# EAGLE design Adafruit VS1053 Amp FeatherWing (EAGLE 6.6.0)
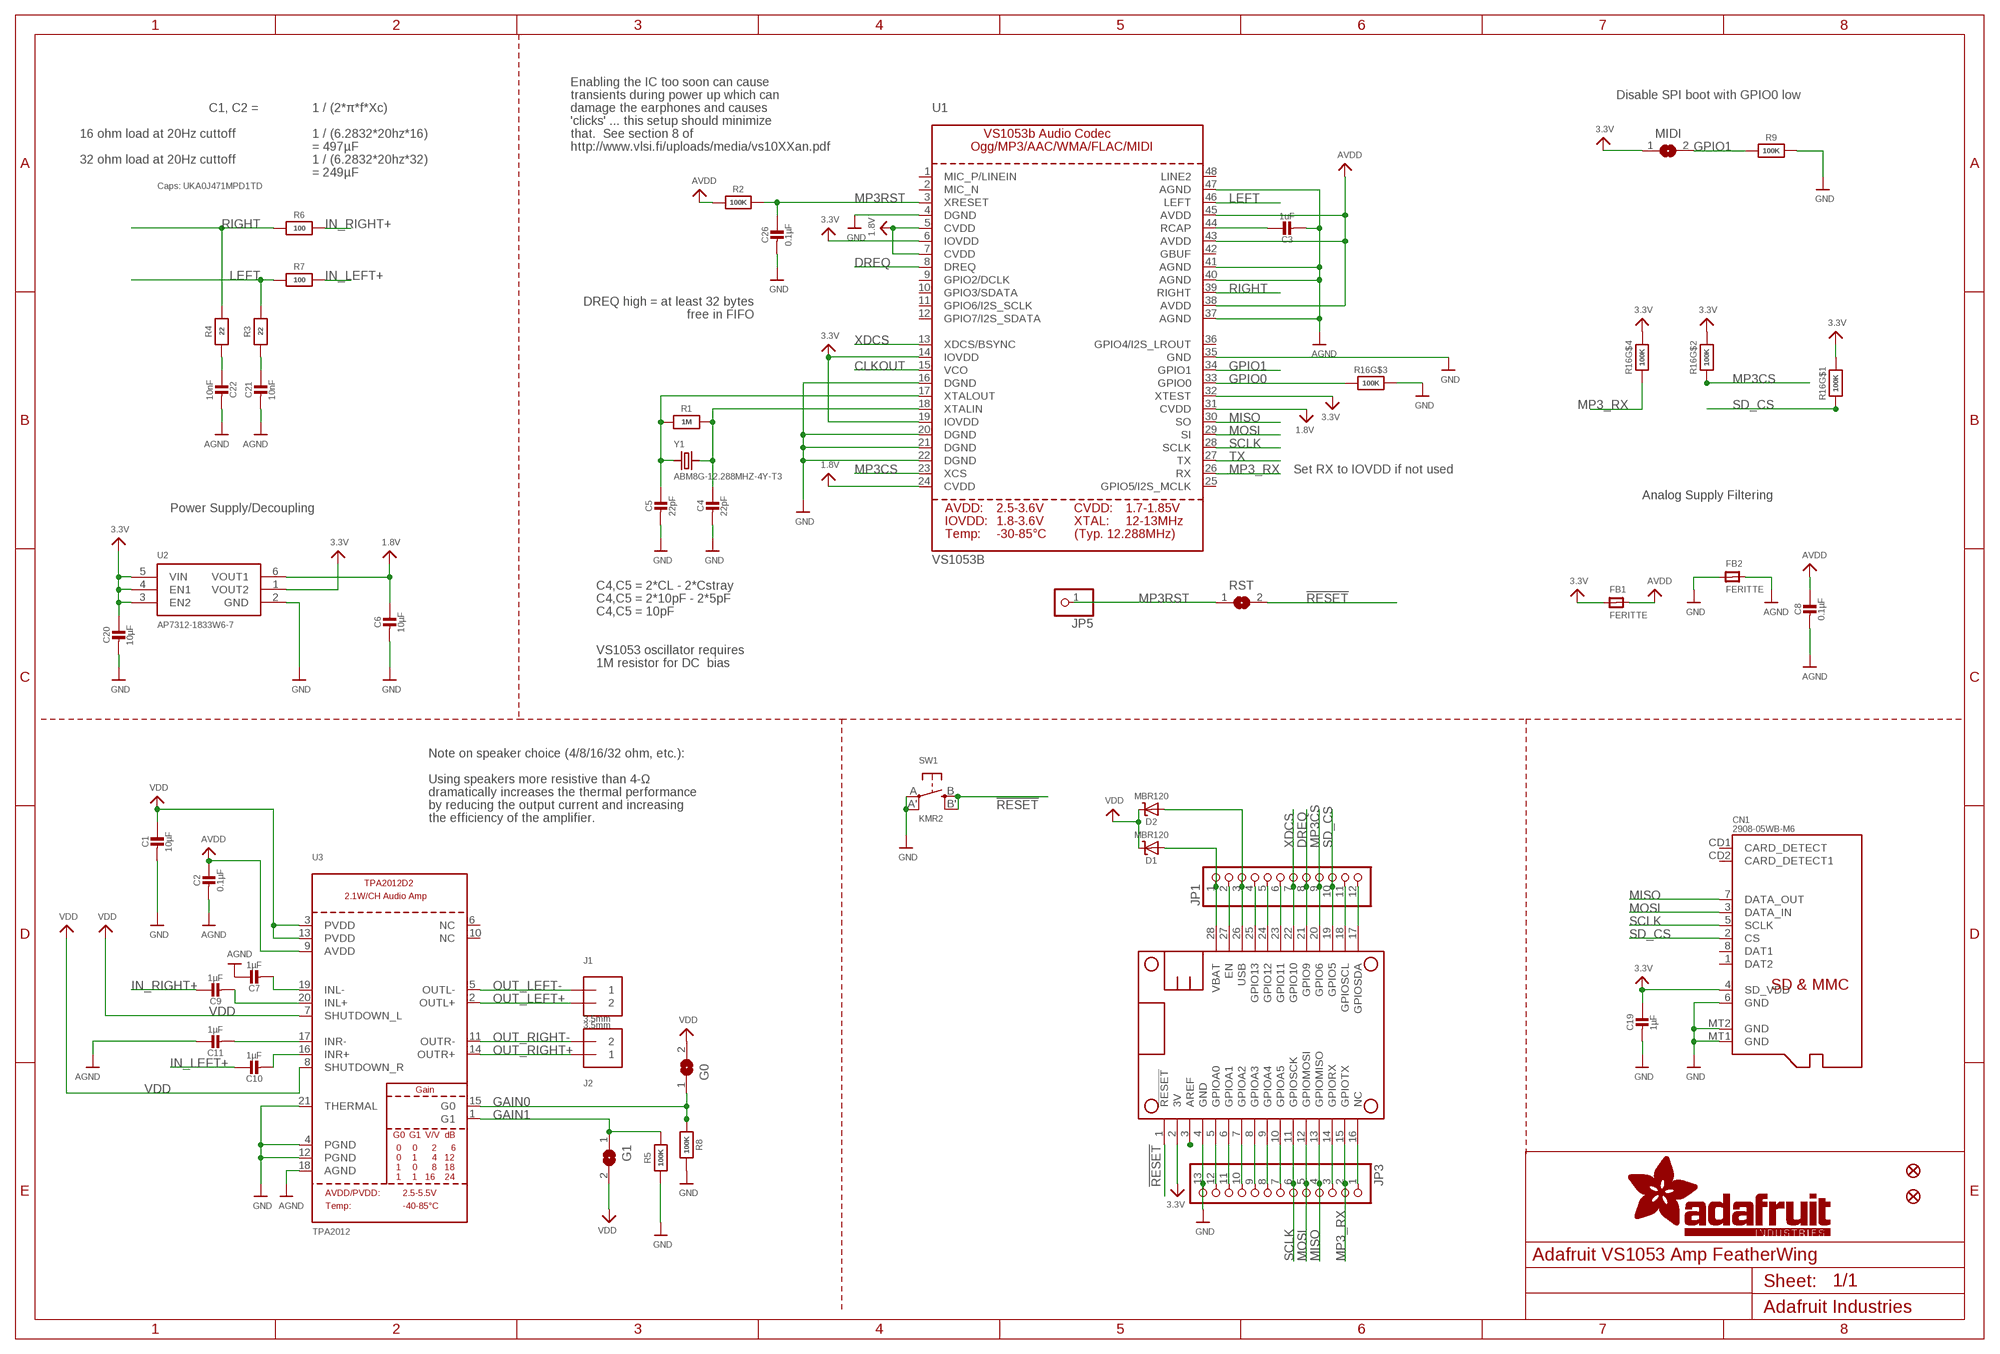
[diagram p0: schematic, sheet 1]

## Parts
C1  10µF  CAP_CERAMIC0805-NOOUTLINE  [0805-NO]
C2  0.1µF  CAP_CERAMIC0603_NO  [0603-NO]
C3  1uF  CAP_CERAMIC0603_NO  [0603-NO]
C4  22pF  CAP_CERAMIC0603_NO  [0603-NO]
C5  22pF  CAP_CERAMIC0603_NO  [0603-NO]
C6  10µF  CAP_CERAMIC_0805MP  [_0805MP]
C7  1µF  CAP_CERAMIC0603_NO  [0603-NO]
C8  0.1µF  CAP_CERAMIC0603_NO  [0603-NO]
C9  1µF  CAP_CERAMIC0603_NO  [0603-NO]
C10  1µF  CAP_CERAMIC0603_NO  [0603-NO]
C11  1µF  CAP_CERAMIC0603_NO  [0603-NO]
C19  1µF  CAP_CERAMIC0603_NO  [0603-NO]
C20  10µF  CAP_CERAMIC0805-NOOUTLINE  [0805-NO]
C21  10nF  CAP_CERAMIC0603_NO  [0603-NO]
C22  10nF  CAP_CERAMIC0603_NO  [0603-NO]
C26  0.1µF  CAP_CERAMIC0603_NO  [0603-NO]
CN1  2908-05WB-M6  MICROSD  [MICROSD]
D1  MBR120  DIODE-SCHOTTKYSOD-123  [SOD-123]
D2  MBR120  DIODE-SCHOTTKYSOD-123  [SOD-123]
FB1  FERITTE  FERRITE-0805NO  [0805-NO]
FB2  FERITTE  FERRITE-0805NO  [0805-NO]
FID1  FIDUCIAL""  [FIDUCIAL_1MM]
FID2  FIDUCIAL""  [FIDUCIAL_1MM]
G0  SOLDERJUMPER  [SOLDERJUMPER_ARROW_NOPASTE]
G1  SOLDERJUMPER  [SOLDERJUMPER_ARROW_NOPASTE]
J1  3.5mm  TERMBLOCK_1X2  [TERMBLOCK_1X2-3.5MM]
J2  3.5mm  TERMBLOCK_1X2  [TERMBLOCK_1X2-3.5MM]
JP1  HEADER-1X12  [1X12_ROUND]
JP3  HEADER-1X13  [1X13_ROUND_70]
JP5  HEADER-1X1ROUND  [1X01_ROUND]
MIDI  SOLDERJUMPER  [SOLDERJUMPER_ARROW_NOPASTE]
MS1  FEATHERWING_NODIM  [FEATHERWING_NODIM]
R1  1M  RESISTOR_0603_NOOUT  [0603-NO]
R2  100K  RESISTOR_0603_NOOUT  [0603-NO]
R3  22  RESISTOR_0603_NOOUT  [0603-NO]
R4  22  RESISTOR_0603_NOOUT  [0603-NO]
R5  100K  RESISTOR_0603_NOOUT  [0603-NO]
R6  100  RESISTOR_0603_NOOUT  [0603-NO]
R7  100  RESISTOR_0603_NOOUT  [0603-NO]
R8  100K  RESISTOR_0603_NOOUT  [0603-NO]
R9  100K  RESISTOR_0603MP  [_0603MP]
R16  100K  RESISTOR_4PACK  [RESPACK_4X0603]
RST  SOLDERJUMPERCLOSED  [SOLDERJUMPER_CLOSEDWIRE]
SW1  KMR2  SWITCH_TACT_SMT4.6X2.8  [BTN_KMR2_4.6X2.8]
U1  VS1053B  [LQFP48]
U2  AP7312-1833W6-7  VREG_SOT23-6_DUALAP7312  [SOT23-6]
U3  TPA2012  AUDIOAMP_TPA2012D2  [WQFN20]
Y1  ABM8G-12.288MHZ-4Y-T3  CRYSTAL3.2X2.5  [CRYSTAL_3.2X2.5]

## Nets
1.8V: C6.1 U1.5(CVDD) U1.7(CVDD) U1.24(CVDD) U1.31(CVDD) U2.6(VOUT1)
3.3V: C19.1 C20.1 CN1.4(SD_VDD) FB1.1 MIDI.1 MS1.2(3V) R16.5 R16.7 R16.8 U1.6(IOVDD) U1.14(IOVDD) U1.19(IOVDD) U1.32(XTEST) U2.1(VOUT2) U2.3(EN2) U2.4(EN1) U2.5(VIN)
!RESET: MS1.1(!RESET) RST.2 SW1.B'(S1) SW1.B(S)
A: JP3.12 MS1.5(GPIOA0)
AGND: C2.2 C3.2 C7.1 C8.2 C11.1 C21.2 C22.2 FB2.2 U1.37(AGND) U1.40(AGND) U1.41(AGND) U1.47(AGND) U3.18(AGND)
AREF: MS1.3(AREF)
AVDD: C2.1 C8.1 FB1.2 R2.1 U1.38(AVDD) U1.43(AVDD) U1.45(AVDD) U3.9(AVDD)
B: JP3.11 MS1.6(GPIOA1)
C: JP3.10 MS1.7(GPIOA2)
CLKOUT: U1.15(VCO)
D: JP3.9 MS1.8(GPIOA3)
DREQ: JP1.8 MS1.21(GPIO9) U1.8(DREQ)
E: JP3.8 MS1.9(GPIOA4)
EN: JP1.2 MS1.27(EN)
F: JP3.7 MS1.10(GPIOA5)
G: JP3.1 MS1.16(NC)
GAIN0: G0.1 R8.1 U3.15(G0)
GAIN1: G1.1 R5.2 U3.1(G1)
GND: C1.2 C4.2 C5.2 C6.2 C19.2 C20.2 C26.2 CN1.6(GND) CN1.MT1(GND) CN1.MT2(GND) FB2.1 JP3.13 MS1.4(GND) R5.1 R8.2 R9.2 R16.6 SW1.A'(P1) SW1.A(P) U1.4(DGND) U1.16(DGND) U1.20(DGND) U1.21(DGND) U1.22(DGND) U1.35(GND) U2.2(GND) U3.4(PGND) U3.12(PGND) U3.21(THERMAL)
GPIO0: R16.3 U1.33(GPIO0)
GPIO1: MIDI.2 R9.1 U1.34(GPIO1)
IN_LEFT+: C10.1 R7.1
IN_RIGHT+: C9.1 R6.1
L: JP1.6 MS1.23(GPIO11)
LEFT: R3.1 R7.2 U1.46(LEFT)
M: JP1.5 MS1.24(GPIO12)
MISO: CN1.7(DATA_OUT) JP3.4 MS1.13(GPIOMISO) U1.30(SO)
MOSI: CN1.3(DATA_IN) JP3.5 MS1.12(GPIOMOSI) U1.29(SI)
MP3_RX: JP3.2 MS1.15(GPIOTX) R16.4 U1.26(RX)
MP3CS: JP1.9 MS1.20(GPIO6) R16.2 U1.23(XCS)
MP3RST: C26.1 JP5.1 R2.2 RST.1 U1.3(XRESET)
N: JP1.4 MS1.25(GPIO13)
N$1: C5.1 R1.1 U1.17(XTALOUT) Y1.1
N$2: C4.1 R1.2 U1.18(XTALIN) Y1.2
N$3: C3.1 U1.44(RCAP)
N$5: C21.1 R3.2
N$6: C22.1 R4.2
N$20: C9.2 U3.20(INL+)
N$21: C7.2 U3.19(INL-)
N$22: C11.2 U3.17(INR-)
N$23: C10.2 U3.16(INR+)
OUT_LEFT+: J1.2 U3.2(OUTL+)
OUT_LEFT-: J1.1 U3.5(OUTL-)
OUT_RIGHT+: J2.1 U3.14(OUTR+)
OUT_RIGHT-: J2.2 U3.11(OUTR-)
RIGHT: R4.1 R6.2 U1.39(RIGHT)
SCL: JP1.11 MS1.18(GPIOSCL)
SCLK: CN1.5(SCLK) JP3.6 MS1.11(GPIOSCK) U1.28(SCLK)
SD_CS: CN1.2(CS) JP1.10 MS1.19(GPIO5) R16.1
SDA: JP1.12 MS1.17(GPIOSDA)
TX: U1.27(TX)
UART_RX: JP3.3 MS1.14(GPIORX)
USB: D2.A JP1.3 MS1.26(USB)
VBAT: D1.A JP1.1 MS1.28(VBAT)
VDD: C1.1 D1.C D2.C G0.2 G1.2 U3.3(PVDD) U3.7(SHUTDOWN_L) U3.8(SHUTDOWN_R) U3.13(PVDD)
XDCS: JP1.7 MS1.22(GPIO10) U1.13(XDCS/BSYNC)
Unconnected: CN1.1(DAT2) CN1.8(DAT1) CN1.CD1(CARD_DETECT) CN1.CD2(CARD_DETECT1) U1.1(MIC_P/LINEIN) U1.2(MIC_N) U1.9(GPIO2/DCLK) U1.10(GPIO3/SDATA) U1.11(GPIO6/I2S_SCLK) U1.12(GPIO7/I2S_SDATA) U1.25(GPIO5/I2S_MCLK) U1.36(GPIO4/I2S_LROUT) U1.42(GBUF) U1.48(LINE2) U3.6(NC) U3.10(NC)

## Notes on the sheet
- Enabling the IC too soon can cause
- transients during power up which can | Disable SPI boot with GPIO0 low
- C1, C2 = | 1 / (2*π*f*Xc) | damage the earphones and causes
- 'clicks' ... this setup should minimize
- 16 ohm load at 20Hz cuttoff | 1 / (6.2832*20hz*16) | that.  See section 8 of
- = 497µF | http://www.vlsi.fi/uploads/media/vs10XXan.pdf
- 32 ohm load at 20Hz cuttoff | 1 / (6.2832*20hz*32)
- = 249µF
- Caps: UKA0J471MPD1TD
- DREQ high = at least 32 bytes
- free in FIFO
- Set RX to IOVDD if not used
- Analog Supply Filtering
- Power Supply/Decoupling
- C4,C5 = 2*CL - 2*Cstray
- C4,C5 = 2*10pF - 2*5pF
- C4,C5 = 10pF
- VS1053 oscillator requires
- 1M resistor for DC  bias
- Note on speaker choice (4/8/16/32 ohm, etc.):
- Using speakers more resistive than 4-Ω
- dramatically increases the thermal performance
- by reducing the output current and increasing
- the efficiency of the amplifier.

## Library data of the parts
C1-C11 C19-C22 C26 = microbuilder:CAP_CERAMIC: Ceramic Capacitors For new designs, use the packages preceded by an '_' character since they are more reliable: The following footprints should be used on most boards: _0402 - Standard footprint for regular board layouts _0603 - Standard footprint for regular board layouts _0805 - Standard footprint for regular board layouts _1206 - Standard footprint for regular board layouts For extremely tight-pitch boards where space is at a premium, the following 'micro-pitch' footprints can be used (smaller pads, no silkscreen outline, etc.): _0402MP - Micro-pitch footprint for very dense/compact boards _0603MP - Micro-pitch footprint for very dense/compact boards _0805MP - Micro-pitch footprint for very dense/compact boards _1206MP - Micro-pitch footprint for very dense/compact boards
CN1 = microbuilder:MICROSD: MicroSD/Transflash Card Holder with SPI pinout 3M: 2908-05WB-MG 4UConnector: 19656 Footprint courtesy: Adafruit Industries
D1 D2 = microbuilder:DIODE-SCHOTTKY
FB1 FB2 = microbuilder:FERRITE: Ferrite Bead 0603 MMZ1608B121C - 120 Ohm @ 100MHz, 600mA, 0.15 Ohm DC Resistance - Digikey: 445-2164-1-ND BK1608HW121-T - 120 Ohm, 600mA Ferrite Chip - Digikey: 587-1876-2-ND 0805 HZ0805B272R-10 - 2.7K Ohm @ 100MHz, 200mA, 0.8 Ohm DC Resistance - Digikey: 240-2504-1-ND (see also Murata BLM21BD272SN1L) MMZ2012Y152B - 1.5K Ohm @ 100MHz, 500mA, 0.4 Ohm DC Resistance - Digikey: 445-1560-1-ND - Mainly for high frequency (80-400MHz) MMZ2012R102A - 1K Ohm @ 100MHz, 500mA, 0.3 Ohm DC Resistance - Digikey: 445-1555-2-ND - More general purpose (10-200MHz)
FID1 FID2 = microbuilder:FIDUCIAL: Fiducial Alignment Points Various fiducial points for machine vision alignment.; BOM: EXCLUDE
G0 G1 MIDI = microbuilder:SOLDERJUMPER: SMD Solder JUMPER Solder the two pads together to create a connection, or remove the solder to break it. REFLOW - Use this footprint for solder paste and reflow ovens. WAVE - Use this footprint for hand-soldering (larger pads). CLOSED - Has a trace between the two pads to ensure it is closed by default. The trace needs to be cut to disable the jumper, and can be closed again by creating a solder bridge between the two pads.; BOM: EXCLUDE
J1 J2 = microbuilder:TERMBLOCK_1X2: 3.5mm Terminal block http://www.ladyada.net/library/pcb/eaglelibrary.html
JP1 = microbuilder:HEADER-1X12
JP3 = microbuilder:HEADER-1X13
JP5 = microbuilder:HEADER-1X1: PIN HEADER
MS1 = microbuilder:FEATHERWING
R1-R9 = microbuilder:RESISTOR: Resistors For new designs, use the packages preceded by an '_' character since they are more reliable: The following footprints should be used on most boards: _0402 - Standard footprint for regular board layouts _0603 - Standard footprint for regular board layouts _0805 - Standard footprint for regular board layouts _1206 - Standard footprint for regular board layouts For extremely tight-pitch boards where space is at a premium, the following 'micro-pitch' footprints can be used (smaller pads, no silkscreen outline, etc.): _0402MP - Micro-pitch footprint for very dense/compact boards _0603MP - Micro-pitch footprint for very dense/compact boards _0805MP - Micro-pitch footprint for very dense/compact boards _1206MP - Micro-pitch footprint for very dense/compact boards
R16 = microbuilder:RESISTOR_4PACK: Resistor Packs (4 resistors) 4 x 0603 10K 1/16W - Digikey: YC164J-10KCT-ND
RST = microbuilder:SOLDERJUMPER: SMD Solder JUMPER Solder the two pads together to create a connection, or remove the solder to break it. REFLOW - Use this footprint for solder paste and reflow ovens. WAVE - Use this footprint for hand-soldering (larger pads). CLOSED - Has a trace between the two pads to ensure it is closed by default. The trace needs to be cut to disable the jumper, and can be closed again by creating a solder bridge between the two pads.
SW1 = microbuilder:SWITCH_TACT_SMT: SMT Tact Switches 6x6mm - Digikey: P12940SCT-ND KMR2 (4.6x2.8mm) - Digikey: 401-1426-1-ND EVQ-PQHB55 - Light Touch, 160GF (4.5x4.5mm) - Digikey: P8090SCT-ND KMT0 - KMT021 NGJ LHS (etc.) IP68/Waterproof - Digikey: CKN10289CT-ND
U1 = microbuilder:VS1053B: VS1053b Audio Codec - Ogg Vorbis/MP3/AAC/WMA/FLAC/MIDI
U2 = microbuilder:VREG_SOT23-6_DUAL: Dual Output SOT23-6 Linear Regulators Diodes Inc. AP7312 - Dual 150mA LDO Linear Regulator 0.2V dropout, 150mA output, 2-6V Input AP7312-1833W6-7 - 1.8V/3.3V SOT23-6 (Digikey: AP7312-1833W6-7DICT-ND) MIC5320 - Dual 150mA ULDO Linear Regulator Ultra-low 35mV dropout at 150mA, 2.3-5.5V Input 3.3V/1.8V SOT23-6 (Digikey: 576-1658-1-ND) 3.3V/1.5V SOT23-6 (Digikey: 576-3483-1-ND)
U3 = microbuilder:AUDIOAMP_TPA2012D2: TPA2012D2 2.1W/CH Stereo Class-D Audio Amp 2.1W/Ch into 4 Ohm at 5V 1.4W/Ch into 8 Ohm at 5V 720mW/Ch into 8 ohm at 3.6V Selectable Gain: 6, 12, 18 or 24 dB Power Supply (PVDD and AVDD): 2.5-5.5V Operating Temperature: -40 to 85°C Digikey (QFN20): 296-17692-1-ND
Y1 = microbuilder:CRYSTAL: Crystals HC49UP - Surface Mount Crystal 4.0MHz 18pF +/-30ppm Surface Mount Crystal [Digikey: 535-9857-1-ND] 12.0 MHz Surface Mount Crystal [Digikey: 535-9869-6-ND] 25.0 MHz Surface Mount Crystal [Digikey: 535-9078-1-ND] 2.5 x 2.0mm - MEMs SMT Crystal 16.0 MHz 10pF 20ppm 2.5 x 2.0mm Crystal [Digikey -40-85°C: 535-10923-1-ND] 3.2 x 2.5mm - MEMs SMT Crystal 12.0 MHz 8pF 15ppm 3.2 x 2.5mm Crystal [Digikey: -10-70°C: 644-1047-1-ND -40-125°C: 644-1128-1-ND] 40~85°C cheaper: 644-1173-6-ND 16.0 MHz 8pF 15ppm 3.2 x 2.5mm Crystal [Digikey: -10-70°C: 644-1049-1-ND -40-125°C: 644-1129-2-ND]-40~85°C cheaper: 644-1175-6-ND 16.0 MHz 10pF 10ppm 3.2 x 2.5mm Crystal [Digikey: 644-1100-1-ND] 27.12 MHz 18pF 30ppm 3.2 x 2.5mm Crystal [Digikey: 887-1424-1-ND] 27.12MHz 10pF 10ppm 3.2 x 2.5mm Crystal [Digikey: 887-1329-1-ND] 4.9 x 1.8mm - MEMs SMT Crystal 32.768 KHz 12.5pF 20ppm 4.9 x 1.8mm Crystal [Digikey: SE2415CT-ND] 8.0 x 3.8mm - Surface Mount Crystal 32.768kHz 12.5pF 20ppm -40°C-85°C [Digikey: 535-9166-2-ND] Cylinder 32.768KHz Cylinder Crystal (2x6mm body) [Ex. Digikey: 300-8341-2-ND]

## Board
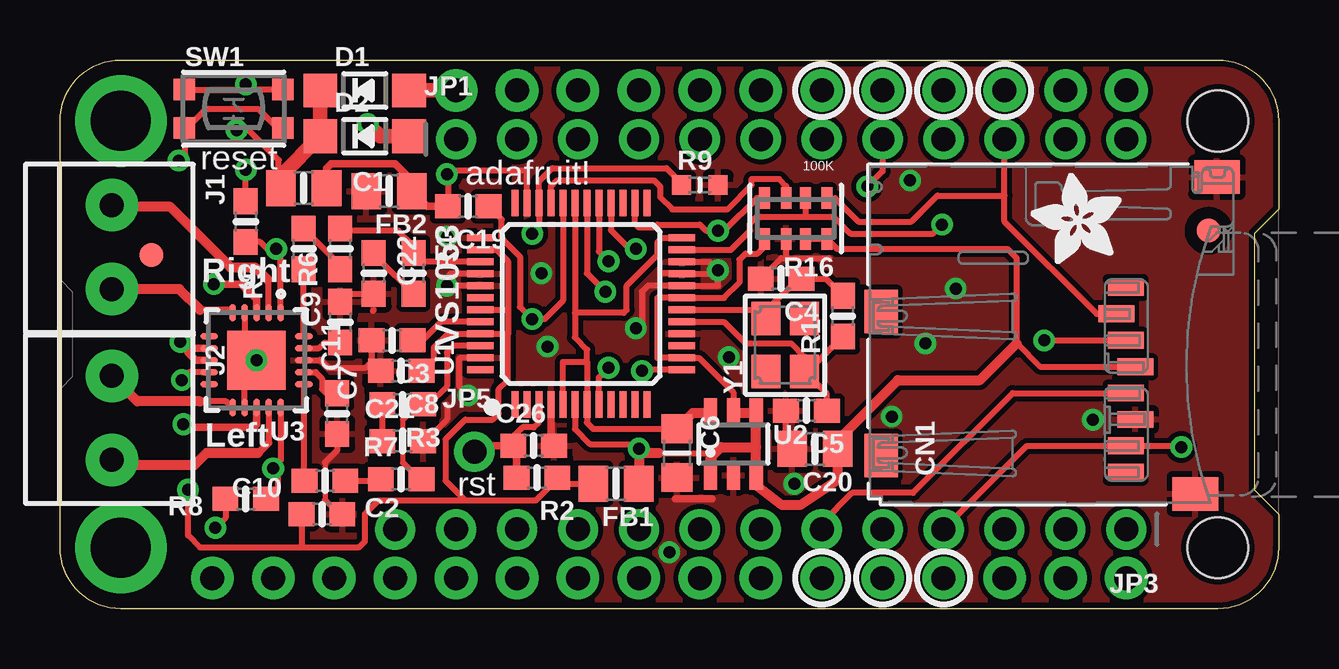
[diagram p1: board, top side]
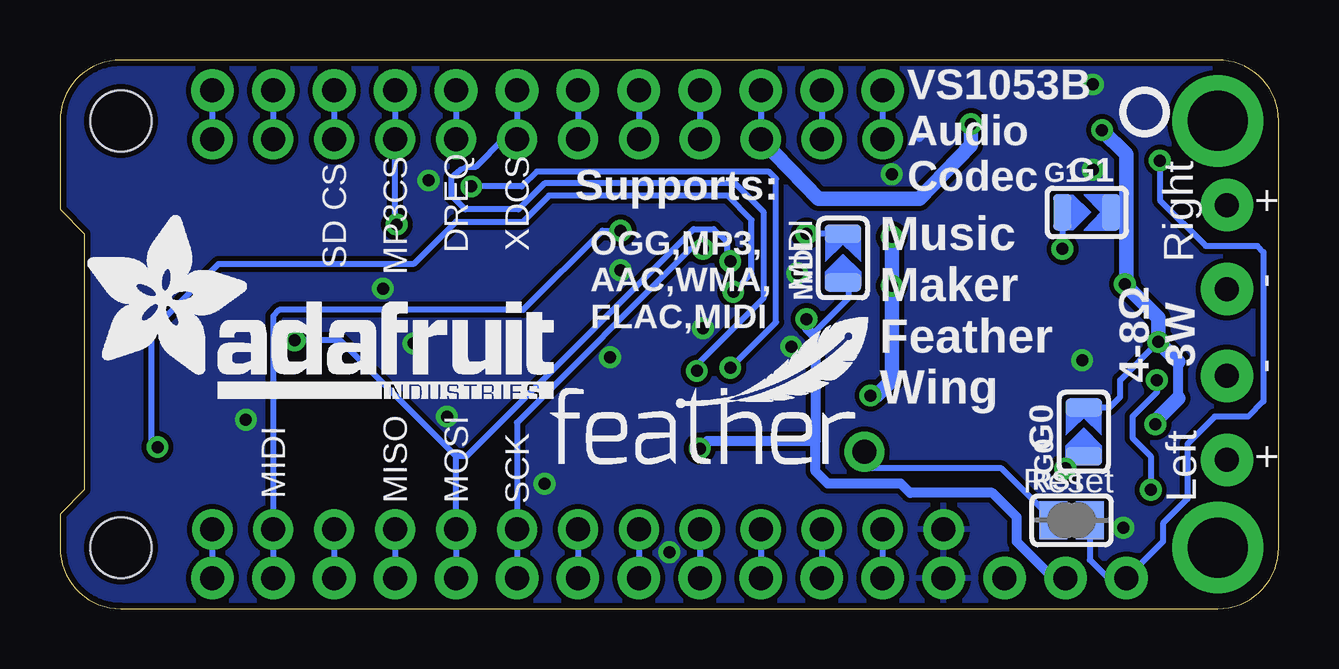
[diagram p2: board, bottom side, seen from below]

Size 50.8 x 22.86 mm. Coordinates in mm from the lower left corner, seen from the top.
Outline: 50.8,20.32 50.8,16.64 49.78,15.62 49.78,4.95 50.8,3.94 50.8,2.54 arc-90 48.26,0 2.54,0 arc-90 0,2.54 0,20.32 arc-90 2.54,22.86 48.26,22.86 arc-90 50.8,20.32
Copper layers (1*16): Top 0.035mm / dielectric 1.5mm / Bottom 0.035mm
Design rules "adafruit *": minimum track width 8mil, minimum drill 15.5mil, track to track 8mil, track to pad 8mil, pad to pad 8mil, via to via 8mil, smd to smd 8mil, copper to edge 10mil, drill to drill 8mil, minimum pad ring 10mil, minimum via ring 8mil, stop-mask expansion 2mil, vias tented up to drill 20mil, thermal gap 10mil
tRestrict: area 17.3,13.6 to 17.8,13.8; area 17.3,15.6 to 17.8,15.8; area 25.7,13.6 to 26.2,13.7; area 25.7,14.1 to 26.2,14.2

### Footprints (pad centres in the part's own frame; a part is rotated, then mirrored left to right if it is on the bottom)
0805-NO = smd 1.24 x 1.5: 1 -0.95,0; 2 0.95,0
0603-NO = smd 1.075 x 1: 1 -0.85,0; 2 0.85,0
_0805MP = smd 1.2 x 1.3: 1 -1.016,0; 2 1.016,0
MICROSD = smd 0.7 x 1.5: 1 9,-10.64; 2 7.9,-10.24; 3 6.8,-10.64; 4 5.7,-11.04; 5 4.6,-10.64; 6 3.5,-11.04; 7 2.4,-10.64; 8 1.3,-10.64 | smd 1.8 x 1.4: CD1 2,-0.44; CD2 8,-0.44 | smd 1.4 x 1.9: MT1 0.4,-13.54; MT2 13.6,-14.44
SOD-123 = smd 1.4 x 1.4: A 1.85,0; C -1.85,0
FIDUCIAL_1MM = smd 1 x 1: 1 0,0
SOLDERJUMPER_ARROW_NOPASTE = smd 0.762 x 1.524: 1 -1.016,0; 2 1.016,0
TERMBLOCK_1X2-3.5MM = drill 1 pad 2.184: 1 1.8,0; 2 -1.7,0
1X12_ROUND = drill 1 pad 1.676: 1 -13.97,0; 2 -11.43,0; 3 -8.89,0; 4 -6.35,0; 5 -3.81,0; 6 -1.27,0; 7 1.27,0; 8 3.81,0; 9 6.35,0; 10 8.89,0; 11 11.43,0; 12 13.97,0
1X13_ROUND_70 = drill 1 pad 1.676: 1 -15.24,0; 2 -12.7,0; 3 -10.16,0; 4 -7.62,0; 5 -5.08,0; 6 -2.54,0; 7 0,0; 8 2.54,0; 9 5.08,0; 10 7.62,0; 11 10.16,0; 12 12.7,0; 13 15.24,0
1X01_ROUND = drill 1 pad 1.676: 1 0,0
FEATHERWING_NODIM = drill 1 pad 1.778: 1 6.35,1.27; 2 8.89,1.27; 3 11.43,1.27; 4 13.97,1.27; 5 16.51,1.27; 6 19.05,1.27; 7 21.59,1.27; 8 24.13,1.27; 9 26.67,1.27; 10 29.21,1.27; 11 31.75,1.27; 12 34.29,1.27; 13 36.83,1.27; 14 39.37,1.27; 15 41.91,1.27; 16 44.45,1.27; 17 44.45,21.59; 18 41.91,21.59; 19 39.37,21.59; 20 36.83,21.59; 21 34.29,21.59; 22 31.75,21.59; 23 29.21,21.59; 24 26.67,21.59; 25 24.13,21.59; 26 21.59,21.59; 27 19.05,21.59; 28 16.51,21.59 | drill 2.5 pad 3.81: P$1 2.54,20.32; P$2 2.54,2.54 | hole 2.54: 48.26,20.32; 48.26,2.54
_0603MP = smd 0.8 x 0.8: 1 -0.762,0; 2 0.762,0
RESPACK_4X0603 = smd 0.45 x 0.9: 1 -1.3,-0.85; 2 -0.4,-0.85; 3 0.4,-0.85; 4 1.3,-0.85; 5 1.3,0.85; 6 0.4,0.85; 7 -0.4,0.85; 8 -1.3,0.85
SOLDERJUMPER_CLOSEDWIRE = smd 1.168 x 1.6: 1 -0.762,0; 2 0.762,0 | smd 0.635 x 0.203: WIRE 0,0
BTN_KMR2_4.6X2.8 = smd 0.9 x 0.9: A 2.05,0.8; A' -2.05,0.8; B 2.05,-0.8; B' -2.05,-0.8
LQFP48 = smd 1.1 x 0.285: 1 -4.2,2.75; 2 -4.2,2.25; 3 -4.2,1.75; 4 -4.2,1.25; 5 -4.2,0.75; 6 -4.2,0.25; 7 -4.2,-0.25; 8 -4.2,-0.75; 9 -4.2,-1.25; 10 -4.2,-1.75; 11 -4.2,-2.25; 12 -4.2,-2.75; 25 4.2,-2.75; 26 4.2,-2.25; 27 4.2,-1.75; 28 4.2,-1.25; 29 4.2,-0.75; 30 4.2,-0.25; 31 4.2,0.25; 32 4.2,0.75; 33 4.2,1.25; 34 4.2,1.75; 35 4.2,2.25; 36 4.2,2.75 | smd 0.285 x 1.1: 13 -2.75,-4.2; 14 -2.25,-4.2; 15 -1.75,-4.2; 16 -1.25,-4.2; 17 -0.75,-4.2; 18 -0.25,-4.2; 19 0.25,-4.2; 20 0.75,-4.2; 21 1.25,-4.2; 22 1.75,-4.2; 23 2.25,-4.2; 24 2.75,-4.2; 37 2.75,4.2; 38 2.25,4.2; 39 1.75,4.2; 40 1.25,4.2; 41 0.75,4.2; 42 0.25,4.2; 43 -0.25,4.2; 44 -0.75,4.2; 45 -1.25,4.2; 46 -1.75,4.2; 47 -2.25,4.2 | smd 0.28 x 1.1: 48 -2.75,4.2
SOT23-6 = smd 0.55 x 1.2: 1 -0.95,-1.3; 2 0,-1.3; 3 0.95,-1.3; 4 0.95,1.3; 5 0,1.3; 6 -0.95,1.3
WQFN20 = smd 0.28 x 0.75: 1 -1,-1.975; 2 -0.5,-1.975; 3 0,-1.975; 4 0.5,-1.975; 5 1,-1.975; 11 1,1.975; 12 0.5,1.975; 13 0,1.975; 14 -0.5,1.975; 15 -1,1.975 | smd 0.75 x 0.28: 6 1.975,-1; 7 1.975,-0.5; 8 1.975,0; 9 1.975,0.5; 10 1.975,1; 16 -1.975,1; 17 -1.975,0.5; 18 -1.975,0; 19 -1.975,-0.5; 20 -1.975,-1 | smd 2.45 x 2.45: 21 0,0
CRYSTAL_3.2X2.5 = smd 1.4 x 1.2: 1 -1.1,-0.8; 2 1.1,0.8; GND1 -1.1,0.8; GND2 1.1,-0.8

### Placement (x,y rotation side)
C1  10.16,17.53 0 top
C2  10.92,3.94 0 top
C3  13.84,11.18 180 top
C4  30.06,13.75 180 top
C5  31.11,8.26 180 top
C6  25.72,6.48 270 top
C7  11.68,11.94 270 top
C8  14.22,9.91 180 top
C9  10.16,14.99 270 top
C10  11.05,5.33 180 top
C11  11.56,8.13 90 top
C19  17.02,16.76 180 top
C20  31.47,6.65 180 top
C21  14.29,6.99 0 top
C22  13.08,13.97 270 top
C26  19.75,6.79 0 top
CN1  33.78,4.38 90 top
D1  12.7,21.59 0 top
D2  12.7,19.68 0 top
FB1  23.18,5.21 180 top
FB2  13.72,17.4 180 top
FID1  47.88,15.75 0 top
FID2  3.81,14.73 270 top
G0  8.13,7.37 90 bottom
G1  8,16.51 0 bottom
J1  2.16,15.11 270 top
J2  2.16,8 270 top
JP1  30.48,19.56 0 top
JP3  29.21,3.3 180 top
JP5  17.27,6.54 0 top
MIDI  18.16,14.61 90 bottom
MS1  0,0 0 top
R1  32.64,12.19 90 top
R2  19.88,5.46 180 top
R3  14.29,8.51 180 top
R4  14.73,13.97 270 top
R5  7.75,16.13 270 top
R6  11.68,14.99 90 top
R7  14.22,5.4 0 top
R8  7.75,4.57 180 top
R9  26.67,17.65 0 top
R16  30.67,16.26 180 top
RST  8.64,3.68 0 bottom
SW1  7.24,20.83 0 top
U1  21.72,12.7 90 top
U2  28.07,6.86 0 top
U3  8.19,10.35 180 top
U$36  [ADAFRUIT_3.5MM]  44.26,14.35 90 top
U$37  [FEATHERLOGO_SMALL]  30.48,5.97 0 bottom
U$43  [PCBFEAT-REV-040]  5.59,20.7 0 bottom
U$55  [ADAFRUIT_TEXT_20MM]  49.81,8.76 0 bottom
Y1  30.23,10.99 90 top

### Tracks (layer width: path | path; a pad name or v marks a point on that pad's centre or on a via)
1.8V
  Top 0.254: U1.5 20.97,10.29 21.97,10.29 | 21.97,10.29 U1.7 21.97,7.75 22.23,7.49 C6.1 | U1.31 21.47,12.32 | 21.47,12.32 21.47,11.3 21.97,10.79 21.97,10.29 | U1.24 25.1,15.45 24.89,15.24 24.89,14.73 23.62,13.46 23.62,12.45 23.5,12.32 21.47,12.32
  Top 0.406: 27.12,7.81 U2.6 26.38,8.16 C6.1
3.3V  (via drill 0.5)
  Top 0.254: R16.7 R16.8 32.39,14.99 39.5,14.99 39.88,14.61 39.88,11.05 40.85,10.08 CN1.4 | U1.32 20.97,12.83 20.2,12.06 v19.68,12.06 19.18,12.57 19.18,14.67 18.41,15.43 18.41,16.22 C19.1 | 24.95,6.48 27.16,6.48 | U1.6 21.47,7.49 22.1,6.86 23.94,6.86 v24.13,6.67 | 24.13,5.66 24.13,5.52 | 29.02,8.44 U2.4 | U2.5 28.07,9.02 26.63,10.45 U1.14 24.89,10.45 24.89,12.95 U1.19 27.68,12.95 28.32,13.59 28.32,14.54 28.57,14.8 29.08,14.8 29.37,15.08 R16.5
  Top 0.406: U2.5 U2.4 29.02,6.74 | 39.88,11.05 38.35,9.53 34.92,9.53 32.42,7.02 C20.1 32.42,5.37 30.86,4.32 30.1,4.32 29.02,5.15 U2.3 29.02,6.74 | v24.13,6.67 24.13,6.48 | 24.13,6.48 24.13,5.66 | 29.02,6.74 29.02,6.73 27.56,6.73 27.12,6.29 U2.1 27.16,5.6 27.16,6.48 | 24.95,6.48 24.13,6.48 | 24.13,5.52 FB1.1
  Bottom 0.254: 19.43,11.43 17.91,12.95 17.91,13.84 MIDI.1
  Bottom 0.406: v19.68,12.06 19.68,11.68 19.43,11.43 19.3,11.3 19.3,6.99 | 19.3,6.99 23.81,6.99 v24.13,6.67 | MS1.2 9.4,1.27 10.92,2.79 10.92,3.81 11.94,4.83 15.37,4.83 15.75,5.21 18.8,5.21 19.3,5.71 19.3,6.99
!RESET  (via drill 0.5)
  Top 0.254: v4.95,18.67 5.19,18.91 SW1.B' 5.3,20.03 6.1,20.83 8.26,20.83 9.05,20.03 SW1.B
  Bottom 0.254: v4.95,18.67 4.95,17.02 3.05,15.11 0.89,15.11 0.64,14.86 0.64,8.64 1.27,8 2.67,8 3.81,6.86 3.81,4.57 4.83,3.56 4.83,2.79 MS1.1 7.11,1.27 7.87,2.03 RST.2
A
  Bottom 0.254: JP3.12 MS1.5
AGND  (via drill 0.5)
  Top 0.203: 11.05,6.1 11.05,4.53
  Top 0.254: U1.40 16.26,13.95 16.26,13.84 | U1.41 v16.13,13.45 | U1.47 16.67,10.45 16.64,10.41 16.64,9.26 v17.02,8.88 | C11.1 11.56,6.6 11.05,6.1 | 11.05,4.53 11.64,3.94 C2.2 | 13.04,12.41 13.08,12.45 | 16.13,8.5 16.13,7.87 15.24,6.99 C21.2 | C3.2 12.99,10.29 | 12.99,10.29 C8.2 | U3.18 10.86,10.35 11.18,10.03 12.74,10.03 12.99,10.29 | C7.1 12.02,13.12 C22.2
  Bottom 0.61: v16.13,15.49 v16.13,13.45 16.13,9.51 16.76,8.88 v17.02,8.88
  pour Top: 0,22.86 18.29,22.73 18.29,0 0,0
AVDD  (via drill 0.5)
  Top 0.254: U1.43 18.66,12.45 18.67,12.45 | 18.67,12.45 18.67,11.43 | 18.67,11.43 17.54,11.43 | 17.54,11.43 U1.45 | 18.67,12.45 18.67,14.48 18.2,14.95 U1.38 | 17.54,11.43 16.13,11.43 15.58,10.88 15.58,10.38 15.11,9.91 C8.1 | 18.67,11.43 18.67,9.53 18.29,9.14 18.29,8.13 18.03,7.87 16.89,7.87 16.07,7.05 16.07,5.33 16.89,4.51 | 16.89,4.51 19.84,4.51 20.73,5.4 R2.1 20.98,5.21 FB1.2 | U3.9 5.41,9.85 v5.08,9.53 | 16.89,4.51 13.27,4.51 12.7,3.94 12.7,2.79 12.45,2.54 10.03,2.54 | 10.03,2.54 5.84,2.54 5.33,3.05 v5.33,4.95 | C2.1 10.07,2.58 10.03,2.54
  Bottom 0.254: v5.08,9.53 5.08,9.02 6.1,8 6.1,7.11 5.33,6.35 v5.33,4.95
B
  Bottom 0.254: JP3.11 MS1.6
C
  Bottom 0.254: JP3.10 MS1.7
D
  Bottom 0.254: JP3.9 MS1.8
DREQ  (via drill 0.5)
  Top 0.254: U1.8 22.47,9.64 v22.86,10.03 | JP1.8 34.29,18.22 v33.66,17.59
  Bottom 0.254: v22.86,10.03 20.95,11.94 20.95,17.91 21.27,18.22 30.92,18.22 31.56,17.59 v33.66,17.59 | MS1.21 JP1.8
E
  Bottom 0.254: JP3.8 MS1.9
EN
  Bottom 0.254: MS1.27 JP1.2
F
  Bottom 0.254: JP3.7 MS1.10
G
  Bottom 0.254: JP3.1 MS1.16
GAIN0  (via drill 0.5)
  Top 0.254: R8.1 9.06,5.04 9.06,5.67 v8.89,5.84 9.19,6.14 U3.15
  Bottom 0.254: 8.76,5.97 v8.89,5.84 8.38,6.35 G0.1
GAIN1  (via drill 0.5)
  Top 0.254: U3.1 9.19,14.81 v9.02,14.99 8.64,14.99 8.34,15.28 R5.2 7.79,15.24 7.87,15.24
  Bottom 0.254: 8.83,14.99 v9.02,14.99 G1.1
GND  (via drill 0.5)
  Top 0.254: U1.35 19.47,18.25 16.35,18.25 16.19,18.1 v16.13,18.1 16.13,18.03 16.17,18 C19.2 | 25.02,13.97 25.9,13.97 U1.21 27.43,13.95 27.43,13.45 U1.20 25.91,13.46 24.51,13.46 24.26,13.21 24.26,11.81 | U3.12 7.69,9.85 U3.21 7.69,10.85 U3.4 | SW1.A' 7.79,21.63 | SW1.A 8.13,21.63 7.79,21.63 | R8.2 6.9,3.79 v6.48,3.37 | R16.6 30.27,14.61 | 30.27,14.61 32.07,14.61 | 30.27,14.61 30.06,14.61 C4.2 | U1.22 27.08,14.45 v27.43,14.1 | R5.1 v7.75,18.29 | C20.2 30.27,6.91 C5.2 | v7.75,21.84 7.75,21.63 7.79,21.63
  Top 0.305: 25.65,4.57 27.18,4.57 | U1.4 20.47,6.79 C26.2 | C1.2 11.11,18.35 11.3,18.54 13.97,18.54 14.67,17.85 FB2.1 15.3,16.76 C19.2
  Bottom 0.254: 19.94,10.79 19.94,10.92 | 14.99,19.56 14.86,19.68
  other vias: 43.05,7.87 25.4,2.35 20.32,10.92 34.67,8 37.34,13.34 36.07,11.05 24,11.68 27.88,10.48 30.61,5.21 8.19,10.35 20.07,13.97 35.43,17.84
  pour Bottom: 0,22.86 50.8,22.86 50.8,0 0,0
  pour Top: 18.92,22.86 19.05,0 50.8,0 50.8,22.86
GPIO0
  Top 0.254: U1.33 20.47,17.61 20.7,17.84 24.77,17.84 25.02,17.59 25.02,17.14 25.53,16.64 27.81,16.64 28.83,17.65 28.83,17.91 29.97,17.91 30.27,17.61 R16.3
GPIO1  (via drill 0.5)
  Top 0.254: v19.68,15.62 19.94,15.88 19.94,16 19.97,16.03 U1.34 19.97,17.81 20.51,18.35 25.27,18.35 25.91,17.72 R9.1
  Bottom 0.254: MIDI.2 v19.68,15.62
IN_LEFT+
  Top 0.254: C10.1 13.31,5.33 R7.1
IN_RIGHT+
  Top 0.254: C9.1 11.68,14.31 R6.1
L
  Bottom 0.254: MS1.23 JP1.6
LEFT
  Top 0.203: 14.29,7.87 14.29,6.1
  Top 0.254: U1.46 16.41,10.95 16.13,10.67 16.13,9.27 15.37,8.51 R3.1 | 15.07,8.45 R3.1 | 14.29,6.1 14.99,5.4 R7.2 | 14.29,7.87 14.92,8.51 R3.1
M
  Bottom 0.254: MS1.24 JP1.5
MISO  (via drill 0.5)
  Top 0.254: U1.30 21.97,13.97 v22.73,13.21 | JP3.4 40.31,6.78 CN1.7 46.69,6.78 v46.74,6.73 46.72,6.72
  Bottom 0.254: v46.74,6.73 46.99,6.99 46.99,11.56 44.2,14.35 36.07,14.35 34.29,16.13 31.5,16.13 30.42,17.21 22.99,17.21 21.97,16.19 21.97,13.97 v22.73,13.21 | JP3.4 MS1.13
MOSI  (via drill 0.5)
  Top 0.254: U1.29 22.47,14.87 v22.86,14.48 | v41.02,11.18 CN1.3
  Bottom 0.254: v22.86,14.48 22.99,14.61 22.99,15.24 23.56,15.81 24.38,15.81 33.85,6.35 34.29,6.35 | 34.29,6.35 39.12,11.18 v41.02,11.18 | MS1.12 JP3.5 34.29,6.35
MP3_RX  (via drill 0.5)
  Top 0.254: U1.26 23.97,16.04 24.13,15.88 24.77,15.88 24.89,16 26.67,16 26.92,15.75 v27.43,15.75 27.69,15.75 29.04,17.11 R16.4
  Bottom 0.254: MS1.15 JP3.2 41.91,12.19 41.66,12.45 31.5,12.45 28.19,15.75 v27.43,15.75
MP3CS  (via drill 0.5)
  Top 0.254: 31.07,16.32 29.02,16.32 28.77,16.07 28.77,15.75 27.97,14.95 U1.23 | 31.07,16.32 32.26,16.32 32.96,15.62 36.39,15.62 v36.77,16 | R16.2 31.07,16.32
  Bottom 0.254: MS1.20 JP1.9 36.83,16.07 v36.77,16
MP3RST
  Top 0.254: U1.3 19.97,7.78 19.75,7.56 19.28,7.56 18.9,7.18 C26.1
  Top 0.305: JP5.1 17.53,6.79 C26.1 19.03,6.67 R2.2
  Bottom 0.254: 17.21,5.84 11.56,5.84 RST.1
  Bottom 0.305: 17.21,5.84 17.27,5.91 JP5.1
N
  Bottom 0.254: MS1.25 JP1.4
N$1
  Top 0.254: U1.17 27.67,11.95 28.57,11.05 30.48,11.05 31.03,10.5 Y1.1 | R1.1 31.31,10.01 31.15,10.01 Y1.1 | C5.1 31.96,8.95 Y1.1
N$2
  Top 0.254: U1.18 29.19,12.45 29.43,12.21 | R1.2 31.93,13.75 C4.1 30.77,13.75 29.72,12.7 29.72,12.51 29.43,12.21 | 29.43,12.21 Y1.2
N$3
  Top 0.254: U1.44 15.89,11.95 15.11,11.18 C3.1
N$5
  Top 0.254: C21.1 R3.2
N$6
  Top 0.254: C22.1 13.04,14.86 13.21,14.86 13.21,14.64 R4.2
N$20
  Top 0.254: U3.20 C9.2
N$21
  Top 0.254: U3.19 10.81,10.85 11.05,11.09 C7.2 11.43,10.83
N$22
  Top 0.254: 11.56,9.11 C11.2 | 11.6,8.98 C11.2 | U3.17 10.66,9.85 10.92,9.59 10.92,9.14 11.09,8.98 C11.2
N$23
  Top 0.254: U3.16 10.17,5.37 C10.2
OUT_LEFT+
  Top 0.254: U3.2 8.69,13.66 8.64,13.72 | 2.16,16.76 J1.2
  Top 0.406: 2.16,16.76 4.57,16.76 7.11,14.22 8.13,14.22 8.64,13.72
OUT_LEFT-
  Top 0.254: U3.5 7.07,12.45 5.84,12.45
  Top 0.406: 5.84,12.45 4.97,13.31 J1.1
OUT_RIGHT+
  Top 0.254: U3.14 8.69,6.91
  Top 0.305: 8.69,6.91 8.26,6.48
  Top 0.406: 8.26,6.48 6.1,6.48 5.59,5.97 2.39,5.97 J2.1
OUT_RIGHT-
  Top 0.254: U3.11 6.93,8.64 5.84,8.64
  Top 0.406: 5.84,8.64 3.22,8.64 J2.2
RIGHT
  Top 0.254: U1.39 15.1,14.45 R4.1 14.73,15.11 14.1,15.75 11.77,15.75 R6.2
SCL
  Bottom 0.254: MS1.18 JP1.11
SCLK  (via drill 0.5)
  Top 0.254: U1.28 22.97,15.77 23.75,14.99 v24,14.99 | JP3.6 31.75,3.56 33.02,4.83 35.56,4.83 39.72,8.98 CN1.5
  Bottom 0.254: JP3.6 MS1.11 | v24,14.99 24.51,14.99 31.75,7.75 JP3.6 | 31.75,3.56 JP3.6
SD_CS
  Top 0.254: 39.37,17.21 39.37,16.13 43.22,12.28 CN1.2 | 39.37,17.21 JP1.10 | 39.37,17.21 36.58,17.21 35.5,16.13 33.28,16.13 32.3,17.11 R16.1
  Bottom 0.254: MS1.19 JP1.10
SDA
  Bottom 0.254: MS1.17 JP1.12
UART_RX
  Bottom 0.254: JP3.3 MS1.14
USB  (via drill 0.5)
  Top 0.61: D2.A 13.34,19.68 v12.83,20.19
  Bottom 0.254: MS1.26 JP1.3
  Bottom 0.61: v12.83,20.19 12.83,19.3 14.99,17.08 19.18,17.08 JP1.3
VBAT
  Top 0.61: D1.A MS1.28
  Bottom 0.254: MS1.28 JP1.1
VDD  (via drill 0.5)
  Top 0.254: 5.28,10.85 v5.02,11.11 | 9.12,17.61 9.12,18.69 7.87,19.94 v7.37,19.94
  Top 0.305: U3.13 8.19,7.68 8.06,7.56 5.27,7.56 v5.14,7.68 | U3.3 8.19,12.89 7.56,13.53 v6.41,13.53 | U3.7 5.28,10.85 | U3.8 5.65,10.35 5.33,10.67 5.33,10.79 v5.02,11.11
  Top 0.406: 9.21,18.05 C1.1 9.12,17.61
  Top 0.61: D1.C D2.C 9.21,18.05
  Bottom 0.254: G0.2 7.05,8.38 6.6,8.83 6.6,9.53 v5.02,11.11 | 6.48,16.51 G1.2 6.35,16.51
  Bottom 0.406: 4.19,8.76 4.19,10.29 | 5.02,7.94 5.02,7.81 v5.14,7.68 | 6.35,13.46 v6.41,13.53
  Bottom 0.61: 5.02,7.94 4.19,8.76 | 4.19,10.29 v5.02,11.11 5.02,12.13 6.35,13.46 6.35,16.51 6.35,18.92 v7.37,19.94
XDCS  (via drill 0.5)
  Top 0.254: U1.13 24.47,9.95 24.42,9.91 v24.26,9.91
  Bottom 0.254: v24.26,9.91 24.26,10.16 21.46,12.95 21.46,16.51 22.67,17.72 30.61,17.72 31.69,16.64 33.91,16.64 34.48,17.21 34.48,17.97 34.1,18.29 33.85,18.41 33.47,18.41 32.32,19.56 JP1.7 | MS1.22 JP1.7 | 31.75,19.24 JP1.7

### Text on the board
tPlace: reset | adafruit! | Right | VS1053 | Left | rst
bPlace: Right | G1 | + | VS1053B / Audio / Codec | Supports: | XDCS | DREQ | MIDI | MP3CS | SD CS | - | Music / Maker / Feather / Wing | OGG,MP3, / AAC,WMA, / FLAC,MIDI | 4-8Ω / 3W | - | G0 | + | SCK | MOSI | MISO | MIDI | Reset | Left